# Altium schematic sheet Power V2.SchDoc
size A; DocumentNumber: 1; SheetNumber: 1; SheetTotal: 3
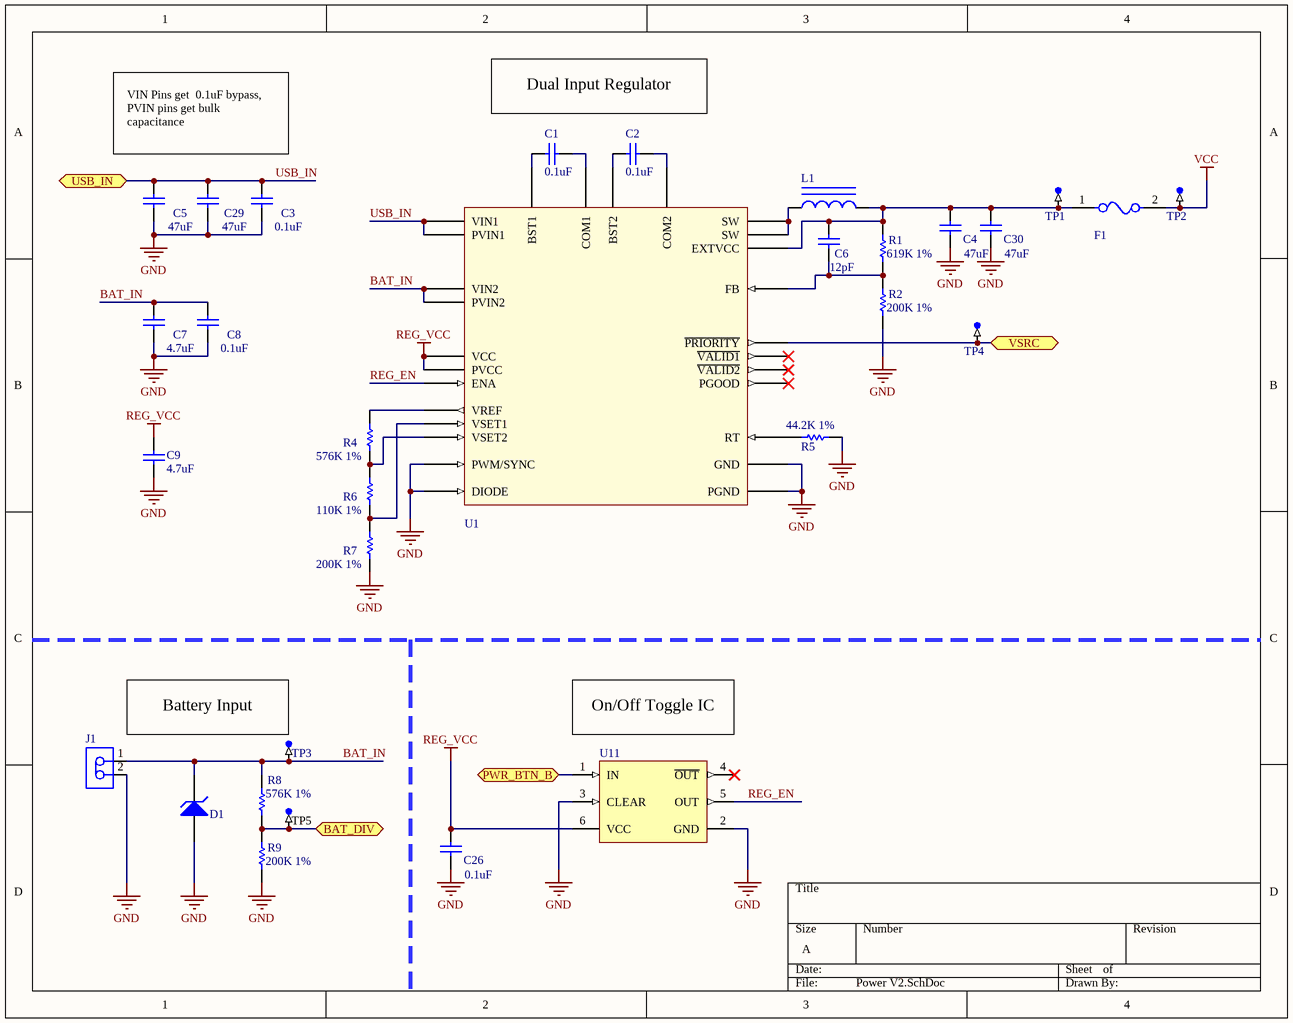
[diagram p0: Power V2.SchDoc]

## Parts
C1  0.1uF  [CAPC0603(1608)100_L]
C2  0.1uF  [CAPC0603(1608)100_L]
C3  0.1uF  [CAPC0603(1608)100_L]
C4  47uF  [CAPC0805(2012)75_N]
C5  47uF  [CAPC0805(2012)75_N]
C6  12pF  [CAPC0603(1608)100_L]
C7  4.7uF  [CAPC0805(2012)75_N]
C8  0.1uF  [CAPC0603(1608)100_L]
C9  4.7uF  [CAPC0805(2012)75_N]
C26  0.1uF  [CAPC0603(1608)100_L]
C29  47uF  [CAPC0805(2012)75_N]
C30  47uF  [CAPC0805(2012)75_N]
D1  XGD10603MR  [TECO-0603_V]  (value not drawn)
F1  1206SFF700F/32-2  [FP-1206SFF-IPC_B]  (value not drawn)
J1  640456-2  [TECO-640456-2_V]  (value not drawn)
L1  2.2uH 5A  [TDK-SLF-6025-2_V]  (value not drawn)
R1  619K 1%  [RESC0603(1608)_N]
R2  200K 1%  [RESC0603(1608)_N]
R4  576K 1%  [RESC0603(1608)_N]
R5  44.2K 1%  [RESC0603(1608)_N]
R6  110K 1%  [RESC0603(1608)_N]
R7  200K 1%  [RESC0603(1608)_N]
R8  576K 1%  [RESC0603(1608)_N]
R9  200K 1%  [RESC0603(1608)_N]
TP1  TP-SM-C-100  [TP-SM-C-100]  (value not drawn)  (no BOM)
TP2  TP-SM-C-100  [TP-SM-C-100]  (value not drawn)  (no BOM)
TP3  TP-SM-C-100  [TP-SM-C-100]  (value not drawn)  (no BOM)
TP4  TP-SM-C-100  [TP-SM-C-100]  (value not drawn)  (no BOM)
TP5  TP-SM-C-100  [TP-SM-C-100]  (value not drawn)  (no BOM)
U1  LTC3126  [TSSOP-28]  (value not drawn)
U11  MAX16054AZT+  [Z6+1_L]  (value not drawn)

## Ports
BAT_DIV (bidir), PWR_BTN_B (bidir), USB_IN (bidir), VSRC (bidir)

## Nets
GND: C3.2 C4.2 C5.1 C7.1 C8.1 C9.2 C26.1 C29.1 C30.2 D1.1(A) J1.2 R2.1 R5.1 R7.1 R9.1 U1.2(PWM/SYNC) U1.11(GND) U1.21(PGND) U1.22(PGND) U1.26(DIODE) U1.29(PGND) U11.2(GND) U11.3(CLEAR)
REG_VCC: C9.1 C26.2 U1.5(VCC) U1.6(PVCC) U11.6(VCC)
VCC: F1.2 TP2.1
BAT_DIV: R8.1 R9.2 TP5.1 ; port BAT_DIV
BAT_IN: C7.2 C8.2 D1.2(K) J1.1 R8.2 TP3.1 U1.1(VIN2) U1.16(PVIN2)
PWR_BTN_B: U11.1(IN) ; port PWR_BTN_B
REG_EN: U1.17(ENA) U11.5(OUT)
USB_IN: C3.1 C5.2 C29.2 U1.27(PVIN1) U1.28(VIN1) ; port USB_IN
VSRC: TP4.1 U1.15(~{PRIORITY}) ; port VSRC
NetC1_1: C1.1 U1.25(BST1)
NetC1_2: C1.2 U1.24(COM1)
NetC2_1: C2.1 U1.19(COM2)
NetC2_2: C2.2 U1.18(BST2)
NetC4_1: C4.1 C6.2 C30.1 F1.1 L1.2 R1.2 TP1.1 U1.7(EXTVCC)
NetC6_1: C6.1 R1.1 R2.2 U1.12(FB)
NetL1_1: L1.1 U1.20(SW) U1.23(SW)
NetR4_1: R4.1 R6.2 U1.9(VSET2)
NetR4_2: R4.2 U1.10(VREF)
NetR5_2: R5.2 U1.13(RT)
NetR6_1: R6.1 R7.2 U1.8(VSET1)

Not connected (* = marked no-connect by the designer): U1 3(~{VALID1})* 4(~{VALID2})* 14(PGOOD)*; U11 4(~{OUT})*

## Notes on the sheet
- VIN Pins get  0.1uF bypass, PVIN pins get bulk capacitance
- Dual Input Regulator
- (near TP3) Battery Input
- (near U11) On/Off Toggle IC

## Library data of the parts
C1-C3 C6 C8 C26 = CMP-1035-00873-1: CAP 27pF 16V ±0.5pF 0603 (1608 Metric) Thickness 1mm SMD; Tolerance: Â±0.5pF; Case-Metric: 1608; Case-EIA: 0603; Value: 27pF; Max Thickness: 1 mm; Rated Voltage: 16 V; Technology: SMT
C4 C5 C7 C9 C29 C30 = CMP-1036-00012-1: CAP 0.5pF 25V ±0.1pF 0805 (2012 Metric) Thickness 0.75mm SMD; Case-EIA: 0805; Case-Metric: 2012; Tolerance: Â±0.1pF; Rated Voltage: 25 V; Max Thickness: 0.75 mm; Value: 0.5pF; Technology: SMT
D1 = CMP-2000-06889-1: ESD Protector Overvoltage Protection Device, 0.25 pF, 24 V, -55 to 125 degC, 2-Pin SMD (0603), RoHS, Tape and Reel; Manufacturer: TE Connectivity; Capacitance Value: 0.25pF; Rad Hardened: No; Leakage Current (Max): 10uA; Clamping Voltage: 45(Typ)V; Product Height (mm): 0.55mm; Working Voltage: 24V; Product Length (mm): 1.7(Max)mm; Direction Type: Bi-Directional; Number of  Elements: 1; Product Depth (mm): 1(Max)mm; Datasheet Version: Rev. G, 11/2012; Package Reference: 0603; Operating Temperature Max Deg. C: 125C; Packaging: TapeandReel/Box; Leakage Current: 10uA; Datasheet URL: https://datasheet.ciiva.com/30563/eng-ss-scd27256-c-30563476.pdf; Mounting: SurfaceMount; Manufacturer URL: http://www.te.com/; Operating Temperature Classification: Military; Reverse Stand-off Voltage: 24V; Working Voltage (Max): 24V; Mounting Style: SurfaceMount; Operating Temperature Min Deg. C: -55C; Operating Temp Range: -55Cto125C; Pin Count: 2; Mounting Technology: SurfaceMount; Package Description: 2-Pin Surface Mount Device, Body 1.60 x 0.825 mm
F1 = CMP-08605-000023-1: FUSE BOARD MOUNT 7A 24VDC 1206; Manufacturer: Littelfuse; Fuse I2T: 1.75A2Sec; Max Fuse Dc Voltage: 32V; Fuse Blow Speed: Fast; Fuse Interrupt Dc Current: 50A; Resistance: 0.011Ω; Value: 0.011Ω; Height: 1.3mm; Automotive: No; Manufacturer Part Number: 1206SFF700F/32-2; Octopart: https://octopart.com/1206sff700f%2F32-2-littelfuse-74214425; Fuse Current: 7A; ComponentLink2Description: Datasheet; Device Class L1: Circuit Protection; Lead Free: Yes; Temperature: -55°C to +125°C; Temperature Range High: +125°C; Device Class L2: Fuses; Category: Fuse; ComponentLink2URL: https://www.littelfuse.com/~/media/electronics/datasheets/fuses/littelfuse_fuse_sff_datasheet.pdf.pdf; Ipc Land Pattern Name: CAPC320160X110; Temperature Range Low: -55°C; RoHS: TRUE; Digikey Description: FUSE BOARD MOUNT 7A 24VDC 1206; Package: 1206SFF; Device Class L3: unset
J1 = CMP-2000-05417-1: Male Header, Pitch 2.54 mm, 1 x 2 Position, Height 10.49 mm, Tail Length 3.556 mm, -55 to 105 degC, RoHS, Bulk; Manufacturer: TE Connectivity; Standards: RoHSCompliant,ELVCompliant,UL94V-0; Material, Housing: Polyester; Agency Approvals: CSA,UL; Brand/Series: MTA-100Series; Contact Centerline Spacing: 0.100 / in.; Material, Contact: CopperAlloy; Current, Rating: 5 / A; Color, Housing: White; Contact Termination Area Plating: Tin; Special Features: Pinstrip; Number of Positions: 2; Pin Spacing: 0.1 / "; Temperature, Operating: -55to+105 / degC; Angle: Straight; Mount Angle: Vertical; Connector Type: MTA-100; Primary Type: InterconnectSystem; Voltage, Rating: 250 / V; Mounting Hole Size: 0.04 / "; Number of Rows: 1; Termination: Solder; Length, Terminal Post: 0.14 / in.; Manufacturer URL: http://www.te.com/; Color: White; Size, Post: 0.025 / in.; Contact Shape: Square; Mounting Type: PCMount; Datasheet URL: https://datasheet.ciiva.com/11746/0900766b80eb7fdd-11746365.pdf; Type: PCBPlug; Datasheet Version: Rev. W, 06/2004; Number of Contacts: 2; Flammability Rating: UL94V-0; Contact Plating: Tin; Length, Pin: 0.14 / "; Contact Mating Area Plating: Tin; Length, Overall: 0.2 / "
L1 = CMP-0745-00001-1: Inductor for Power Ciruits, 10 uH +/-20% Tolerance, 1A, -40 to 105 degC, 6 x 6 x 2.5 mm Lx W x H, RoHS, Tape and Reel; PartNumber: SLF6025T-100M1R0-PF; Manufacturer: TDK; Inductance: 10 uH; ComponentLink1Description: Manufacturer URL; PackageDescription: 2-Pin SMD, Body 6 x 6 mm, Height 2.5 mm; ComponentLink2URL: http://product.tdk.com/inductor/ind/en/documents/inductor_commercial_power_slf_en.pdf; ComponentLink2Description: Datasheet; ComponentLink3URL: http://product.tdk.com/inductor/ind/en/documents/inductor_commercial_power_slf_en.pdf; DatasheetVersion: Jul-13; Rated current: 1 A; Mounting Technology: Surface Mount; ComponentLink1URL: http://www.global.tdk.com/; ComponentLink3Description: Package Specification; Inductance tolerance: +/-20%; PackageVersion: Jul-13; Operating temperature: -40 to 105 degC; PackageReference: SLF-6025-2; RoHS: TRUE; Packing: Tape and Reel
R1 R2 R4-R9 = CMP-1012-00001-1: Jumper 0603 (1608 Metric); Case-Metric: 1608; Value: 0.00 Ohm; Power: None; Case-EIA: 0603; Technology: SMT; Tolerance: None
TP1-TP5 = CMP-0484-00002-2: Test Point, Surface Mount, Circular, Pad Diameter 1 mm; Manufacturer: No Vendor; PartNumber: TP-SM-C-100
U11 = CMP-0251-00628-1: On/Off Controller with Debounce and +/-15kV ESD Protection, 6-Pin SOT, -40°C to +125°C, Pb-Free; ComponentLink3Description: Package Specification; PackageReference: z6+1; DatasheetVersion: Rev 0, May-2008; Code_JEITA: SC-74; ComponentLink2Description: Datasheet; ComponentLink1Description: Manufacturer URL; ComponentLink2URL: http://datasheets.maxim-ic.com/en/ds/MAX16054.pdf; PackageVersion: revD, 2011; ComponentLink1URL: http://www.maxim-ic.com; ComponentLink3URL: http://pdfserv.maxim-ic.com/package_dwgs/21-0114.PDF; PackageDescription: 6-Pin Thin Small-Outline Transistor, 2.9 x 1.6 mm Body, 0.95 mm Pitch, 2.8 mm Lead Span, SOT-23, Pb-Free; Code_JEDEC: MO-193*